# EAGLE design polarshield3.0c-opl (EAGLE 7.2.0)
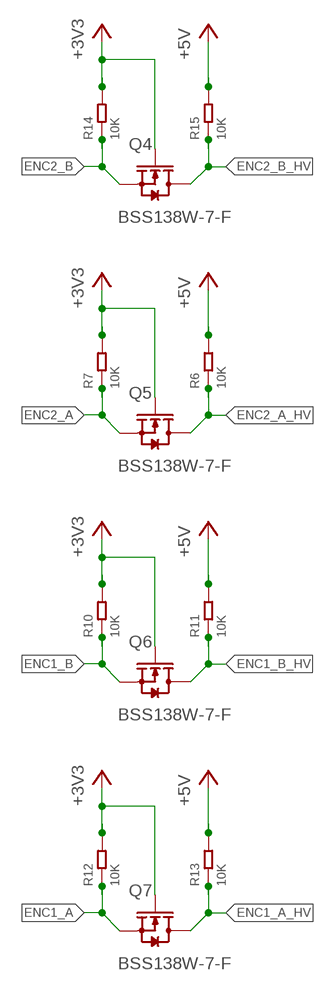
[diagram p0: schematic, sheet 1, part 1 of 2]
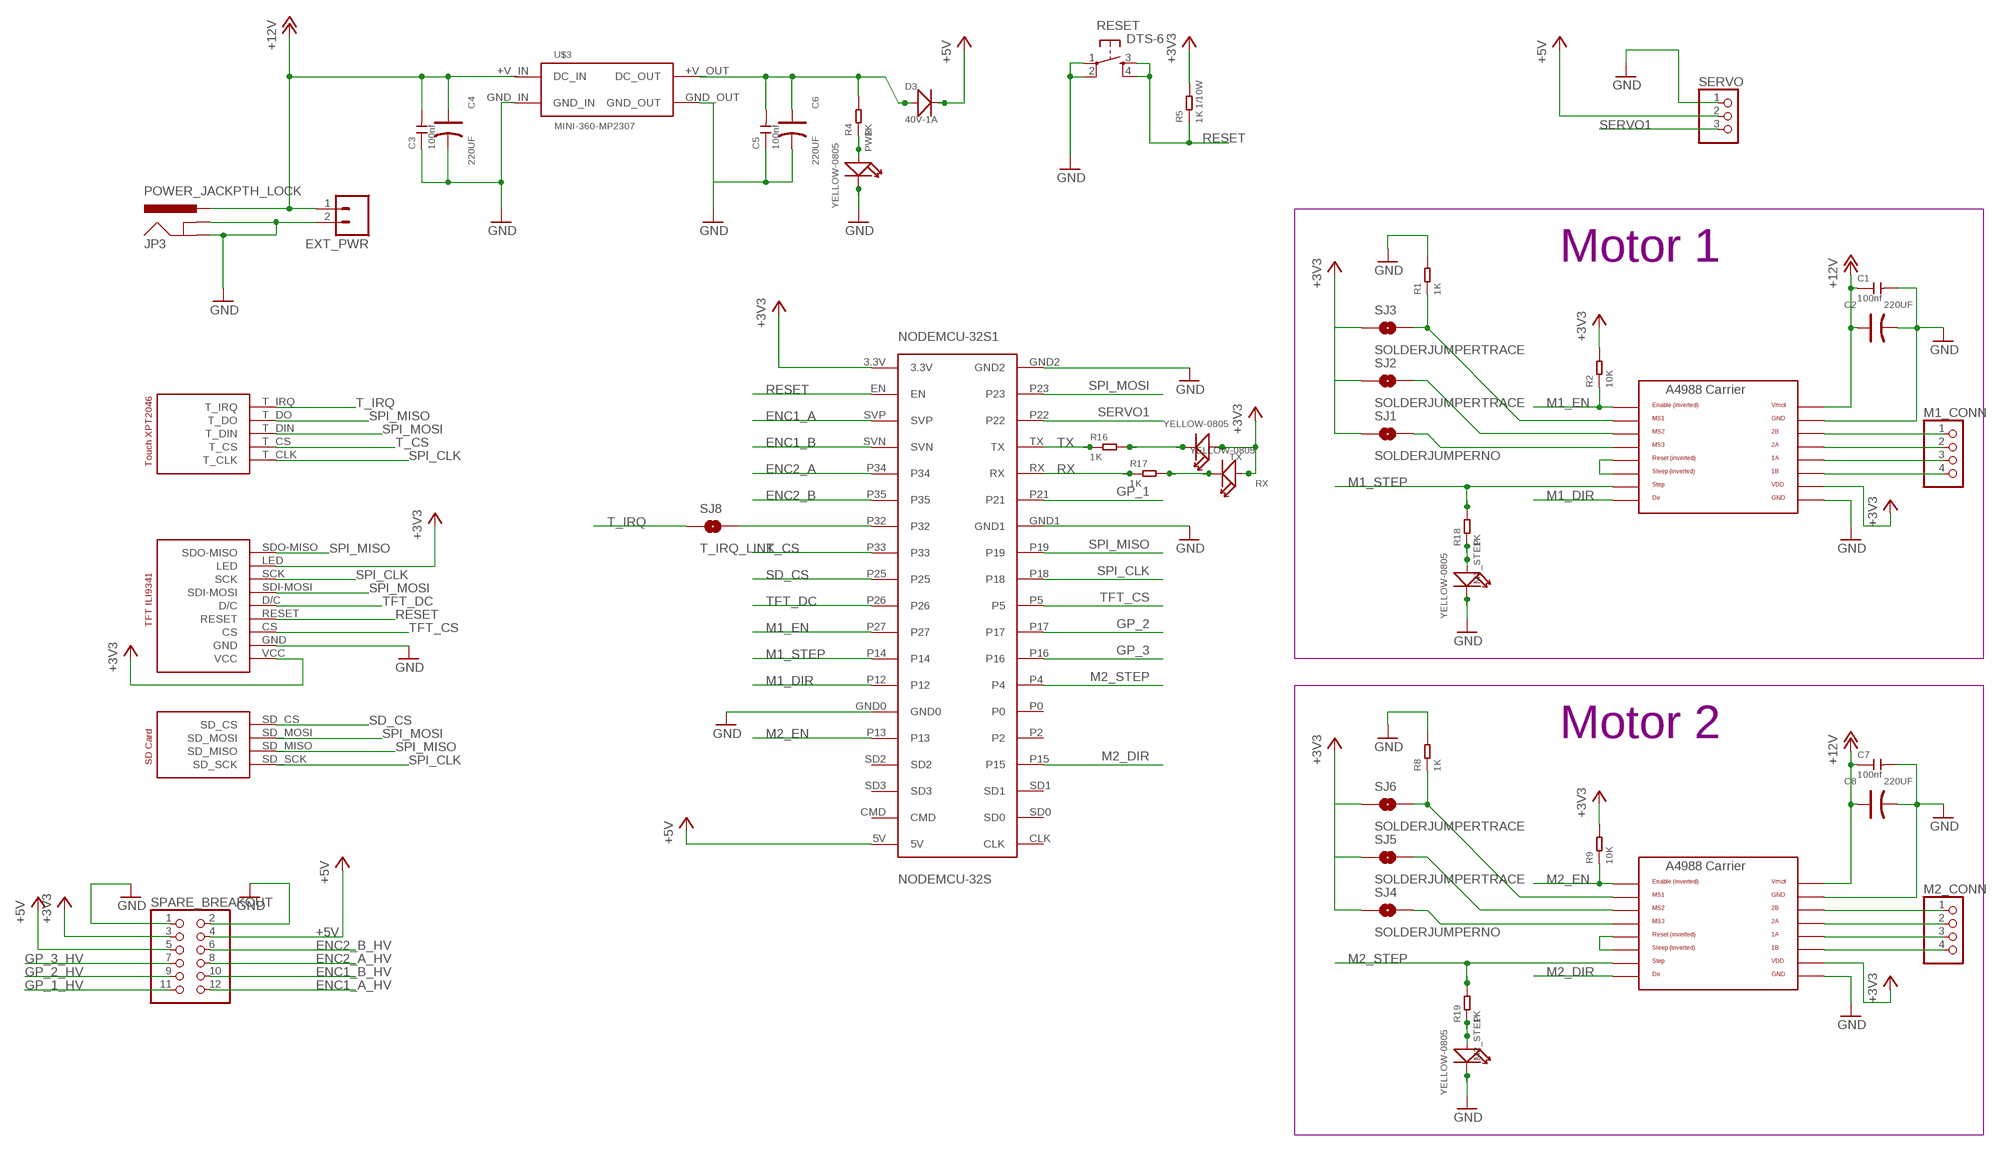
[diagram p1: schematic, sheet 1, part 2 of 2]

## Parts
C1  100nf  CERAMIC-100NF-50V-10%-X7R(0603)  [C0603]
C2  220UF  ALUMINUM-SMD-220UF-16V(D6.3-H7.7MM)  [ELECTRO-SMD-C-6MM]
C3  100nf  CERAMIC-100NF-50V-10%-X7R(0603)  [C0603]
C4  220UF  ALUMINUM-SMD-220UF-16V(D6.3-H7.7MM)  [ELECTRO-SMD-C-6MM]
C5  100nf  CERAMIC-100NF-50V-10%-X7R(0603)  [C0603]
C6  220UF  ALUMINUM-SMD-220UF-16V(D6.3-H7.7MM)  [ELECTRO-SMD-C-6MM]
C7  100nf  CERAMIC-100NF-50V-10%-X7R(0603)  [C0603]
C8  220UF  ALUMINUM-SMD-220UF-16V(D6.3-H7.7MM)  [ELECTRO-SMD-C-6MM]
D3  40V-1A  SMD-DIODE-SCHOTTKY-40V-1A(DO-214AC)  [DO-214AC]
EXT_PWR  M02PTH  [1X02]
JP3  POWER_JACKPTH_LOCK  [POWER_JACK_PTH_LOCK]
M1_CONN  PINHD-1X4/90  [1X04/90]
M1_STEP  YELLOW-0805  SMD-LED-CLEAR-YELLOW(0805)  [LED-0805]
M2_CONN  PINHD-1X4/90  [1X04/90]
M2_STEP  YELLOW-0805  SMD-LED-CLEAR-YELLOW(0805)  [LED-0805]
MOTOR_1  A4988BREAKOUT  [A4988BREAKOUT]
MOTOR_2  A4988BREAKOUT  [A4988BREAKOUT]
NODEMCU-32S1  NODEMCU-32S  [NODEMCU-32S]
PWR  YELLOW-0805  SMD-LED-CLEAR-YELLOW(0805)  [LED-0805]
Q4  BSS138W-7-F  SMD-MOSFET-N-CH-50V-200MA-BSS138W-7-F(SOT-23)  [SOT-23]
Q5  BSS138W-7-F  SMD-MOSFET-N-CH-50V-200MA-BSS138W-7-F(SOT-23)  [SOT-23]
Q6  BSS138W-7-F  SMD-MOSFET-N-CH-50V-200MA-BSS138W-7-F(SOT-23)  [SOT-23]
Q7  BSS138W-7-F  SMD-MOSFET-N-CH-50V-200MA-BSS138W-7-F(SOT-23)  [SOT-23]
R1  1K  SMD-RES-1K-5%-1/10W(0603)  [R0603]
R2  10K  SMD-RES-10K-5%-1/10W(0603)  [R0603]
R4  1K  SMD-RES-1K-5%-1/10W(0603)  [R0603]
R5  1K 1/10W  SMD-RES-1K-5%-1/10W(0603)  [R0603]
R6  10K  SMD-RES-10K-5%-1/10W(0603)  [R0603]
R7  10K  SMD-RES-10K-5%-1/10W(0603)  [R0603]
R8  1K  SMD-RES-1K-5%-1/10W(0603)  [R0603]
R9  10K  SMD-RES-10K-5%-1/10W(0603)  [R0603]
R10  10K  SMD-RES-10K-5%-1/10W(0603)  [R0603]
R11  10K  SMD-RES-10K-5%-1/10W(0603)  [R0603]
R12  10K  SMD-RES-10K-5%-1/10W(0603)  [R0603]
R13  10K  SMD-RES-10K-5%-1/10W(0603)  [R0603]
R14  10K  SMD-RES-10K-5%-1/10W(0603)  [R0603]
R15  10K  SMD-RES-10K-5%-1/10W(0603)  [R0603]
R16  1K  SMD-RES-1K-5%-1/10W(0603)  [R0603]
R17  1K  SMD-RES-1K-5%-1/10W(0603)  [R0603]
R18  1K  SMD-RES-1K-5%-1/10W(0603)  [R0603]
R19  1K  SMD-RES-1K-5%-1/10W(0603)  [R0603]
RESET  DTS-6  [DTS-6]
RX  YELLOW-0805  SMD-LED-CLEAR-YELLOW(0805)  [LED-0805]
SERVO  PINHD-1X3/90  [1X03/90]
SJ1  SOLDERJUMPERNO  [SJ_2S-NO]
SJ2  SOLDERJUMPERTRACE  [SJ_2S-TRACE]
SJ3  SOLDERJUMPERTRACE  [SJ_2S-TRACE]
SJ4  SOLDERJUMPERNO  [SJ_2S-NO]
SJ5  SOLDERJUMPERTRACE  [SJ_2S-TRACE]
SJ6  SOLDERJUMPERTRACE  [SJ_2S-TRACE]
SJ8  T_IRQ_LINK  SOLDERJUMPERNO  [SJ_2S-NO]
SPARE_BREAKOUT  PINHD-2X6  [2X06]
TX  YELLOW-0805  SMD-LED-CLEAR-YELLOW(0805)  [LED-0805]
U$2  2.4_TFT_SPI_TOUCH_SD  [2.4_TFT_SPI_TOUCH_SD]
U$3  MINI-360-MP2307  [MINI-360-MP2307]

## Nets
+3V3 [VCC]: MOTOR_1.VDD MOTOR_2.VDD NODEMCU-32S1.3.3V Q4.1(G) Q5.1(G) Q6.1(G) Q7.1(G) R2.2 R5.2 R7.2 R9.2 R10.2 R12.2 R14.2 RX.+ SJ1.1 SJ2.1 SJ3.1 SJ4.1 SJ5.1 SJ6.1 SPARE_BREAKOUT.3 TX.+ U$2.LED U$2.VCC
+5V [VCC]: D3.2(-) NODEMCU-32S1.5V R6.2 R11.2 R13.2 R15.2 SERVO.2 SPARE_BREAKOUT.4 SPARE_BREAKOUT.5
+12V [VMOT]: C1.1 C2.+ C3.2 C4.+ C7.1 C8.+ EXT_PWR.1 JP3.PWR MOTOR_1.VMOT MOTOR_2.VMOT U$3.+V_IN(DC_IN)
ENC1_A: NODEMCU-32S1.SVP Q7.2(S) R12.1
ENC1_A_HV: Q7.3(D) R13.1 SPARE_BREAKOUT.12
ENC1_B: NODEMCU-32S1.SVN Q6.2(S) R10.1
ENC1_B_HV: Q6.3(D) R11.1 SPARE_BREAKOUT.10
ENC2_A: NODEMCU-32S1.P34 Q5.2(S) R7.1
ENC2_A_HV: Q5.3(D) R6.1 SPARE_BREAKOUT.8
ENC2_B: NODEMCU-32S1.P35 Q4.2(S) R14.1
ENC2_B_HV: Q4.3(D) R15.1 SPARE_BREAKOUT.6
GND [GND]: C1.2 C2.- C3.1 C4.- C5.1 C6.- C7.2 C8.- EXT_PWR.2 JP3.GND JP3.GNDBREAK M1_STEP.- M2_STEP.- MOTOR_1.GND MOTOR_1.GND@0(GND) MOTOR_2.GND MOTOR_2.GND@0(GND) NODEMCU-32S1.GND0 NODEMCU-32S1.GND1 NODEMCU-32S1.GND2 PWR.- R1.2 R8.2 RESET.1 RESET.2 SERVO.1 SPARE_BREAKOUT.1 SPARE_BREAKOUT.2 U$2.GND U$3.GND_IN U$3.GND_OUT
GP_1: NODEMCU-32S1.P21
GP_1_HV: SPARE_BREAKOUT.11
GP_2: NODEMCU-32S1.P17
GP_2_HV: SPARE_BREAKOUT.9
GP_3: NODEMCU-32S1.P16
GP_3_HV: SPARE_BREAKOUT.7
M1_DIR: MOTOR_1.DIR NODEMCU-32S1.P12
M1_EN: MOTOR_1.EN NODEMCU-32S1.P27 R2.1
M1_STEP: MOTOR_1.STEP NODEMCU-32S1.P14 R18.2
M2_DIR: MOTOR_2.DIR NODEMCU-32S1.P15
M2_EN: MOTOR_2.EN NODEMCU-32S1.P13 R9.1
M2_STEP: MOTOR_2.STEP NODEMCU-32S1.P4 R19.2
N$1: NODEMCU-32S1.P32 SJ8.2
N$2: MOTOR_1.RST MOTOR_1.SLP(SLEEP)
N$3: MOTOR_1.MS3 SJ1.2
N$4: MOTOR_1.MS2 SJ2.2
N$5: MOTOR_1.MS1 R1.1 SJ3.2
N$6: M1_STEP.+ R18.1
N$7 [VCC]: C5.2 C6.+ D3.1(+) R4.2 U$3.+V_OUT(DC_OUT)
N$8: PWR.+ R4.1
N$9: MOTOR_2.MS3 SJ4.2
N$10 [VMOT]: M1_CONN.1 MOTOR_1.2B
N$11 [VMOT]: M1_CONN.2 MOTOR_1.2A
N$12 [VMOT]: M1_CONN.3 MOTOR_1.1A
N$13 [VMOT]: M1_CONN.4 MOTOR_1.1B
N$14: R16.2 TX.-
N$15: R17.2 RX.-
N$16: MOTOR_2.MS2 SJ5.2
N$17: MOTOR_2.MS1 R8.1 SJ6.2
N$18: MOTOR_2.RST MOTOR_2.SLP(SLEEP)
N$19: M2_STEP.+ R19.1
N$20 [VMOT]: M2_CONN.1 MOTOR_2.2B
N$21 [VMOT]: M2_CONN.2 MOTOR_2.2A
N$22 [VMOT]: M2_CONN.3 MOTOR_2.1A
N$23 [VMOT]: M2_CONN.4 MOTOR_2.1B
RESET: NODEMCU-32S1.EN R5.1 RESET.3 RESET.4 U$2.RESET
RX: NODEMCU-32S1.RX R17.1
SD_CS: NODEMCU-32S1.P25 U$2.SD_CS
SERVO1: NODEMCU-32S1.P22 SERVO.3
SPI_CLK: NODEMCU-32S1.P18 U$2.SCK U$2.SD_SCK U$2.T_CLK
SPI_MISO: NODEMCU-32S1.P19 U$2.SD_MISO U$2.SDO-MISO U$2.T_DO
SPI_MOSI: NODEMCU-32S1.P23 U$2.SD_MOSI U$2.SDI-MOSI U$2.T_DIN
T_CS: NODEMCU-32S1.P33 U$2.T_CS
T_IRQ: SJ8.1 U$2.T_IRQ
TFT_CS: NODEMCU-32S1.P5 U$2.CS
TFT_DC: NODEMCU-32S1.P26 U$2.D/C
TX: NODEMCU-32S1.TX R16.1
Unconnected: NODEMCU-32S1.CLK NODEMCU-32S1.CMD NODEMCU-32S1.P0 NODEMCU-32S1.P2 NODEMCU-32S1.SD0 NODEMCU-32S1.SD1 NODEMCU-32S1.SD2 NODEMCU-32S1.SD3

## Notes on the sheet
- Motor 1
- Motor 2

## Library data of the parts
C1 C3 C5 C7 = Seeed-Capacitor:CERAMIC-100NF-50V-10%-X7R(0603): 302010138; MPN: CC0603KRX7R9BB104
C2 C4 C6 C8 = Seeed-Capacitor:ALUMINUM-SMD-220UF-16V(D6.3-H7.7MM): 302030053; MPN: CS1E221M-CRE77
D3 = Seeed-Diode:SMD-DIODE-SCHOTTKY-40V-1A(DO-214AC): 304020027; MPN: 1N5819
EXT_PWR = SparkFun-Connectors:M02: Standard 2-pin 0.1" header. Use with - straight break away headers ( PRT-00116) - right angle break away headers (PRT-00553) - swiss pins (PRT-00743) - machine pins (PRT-00117) - female headers (PRT-00115) Molex polarized connector foot print use with: PRT-08233 with associated crimp pins and housings. 2.54_SCREWTERM for use with PRT-10571. 3.5mm Screw Terminal footprints for PRT-08084 5mm Screw Terminal footprints for use with PRT-08432
JP3 = SparkFun-Connectors:POWER_JACK: Power Jack This is the standard 5.5mm barrel jack for power. The PTH is the most common, proven, reliable, footprint. The Slot footprint only works if the mill layer is transmitted to the PCB fab house so be warned. Mating wall wart : TOL-00298 (and others); PROD_ID: CONN-08197; SF_ID: PRT-00119
M1_CONN M2_CONN = pinhead:PINHD-1X4: PIN HEADER
M1_STEP M2_STEP PWR RX TX = Seeed-LED:SMD-LED-CLEAR-YELLOW(0805): 304090039; MPN: 17-215UYC/S530-A3/TR8
MOTOR_1 MOTOR_2 = sandy:A4988BREAKOUT
NODEMCU-32S1 = sandy:NODEMCU-32S
Q4-Q7 = Seeed-Transistor:SMD-MOSFET-N-CH-50V-200MA-BSS138W-7-F(SOT-23): 305030000; MPN: BSS138W-7-F
R1 R4 R8 R16-R19 = Seeed-Resistor:SMD-RES-1K-5%-1/10W(0603): 301010291; MPN: RC0603JR-071KL; VALUE: 1K 1/10W
R2 R6 R7 R9-R15 = Seeed-Resistor:SMD-RES-10K-5%-1/10W(0603): 301010293; MPN: RC0603JR-0710KL; VALUE: 10K 1/10W
R5 = Seeed-Resistor:SMD-RES-1K-5%-1/10W(0603): 301010291; MPN: RC0603JR-071KL
RESET = switch-tact:DTS-6
SERVO = pinhead:PINHD-1X3: PIN HEADER
SJ1-SJ6 = polargraph3:SOLDERJUMPER: Solder Jumper Standard SMD solder jumper. Used to automate production. Two varients : Normally Open and Normally Closed are the same, but have different paste layers. NC will have a large amount of paste and should jumper during reflow.
SJ8 = SparkFun-Retired:SOLDERJUMPER: Solder Jumper Standard SMD solder jumper. Used to automate production. Two varients : Normally Open and Normally Closed are the same, but have different paste layers. NC will have a large amount of paste and should jumper during reflow.
SPARE_BREAKOUT = pinhead:PINHD-2X6: PIN HEADER
U$2 = polargraph3:2.4_TFT_SPI_TOUCH_SD
U$3 = polargraph3:MINI-360-MP2307

## Net classes
0 signal: width 0.254 mm, drill 0.152 mm, clearance 0.203 mm
1 VMOT: width 1.118 mm, drill 0.152 mm, clearance 0.305 mm
2 VCC: width 0.61 mm, drill 0.152 mm, clearance 0.203 mm
3 GND: width 0.305 mm, drill 0.152 mm, clearance 0.203 mm

## Board
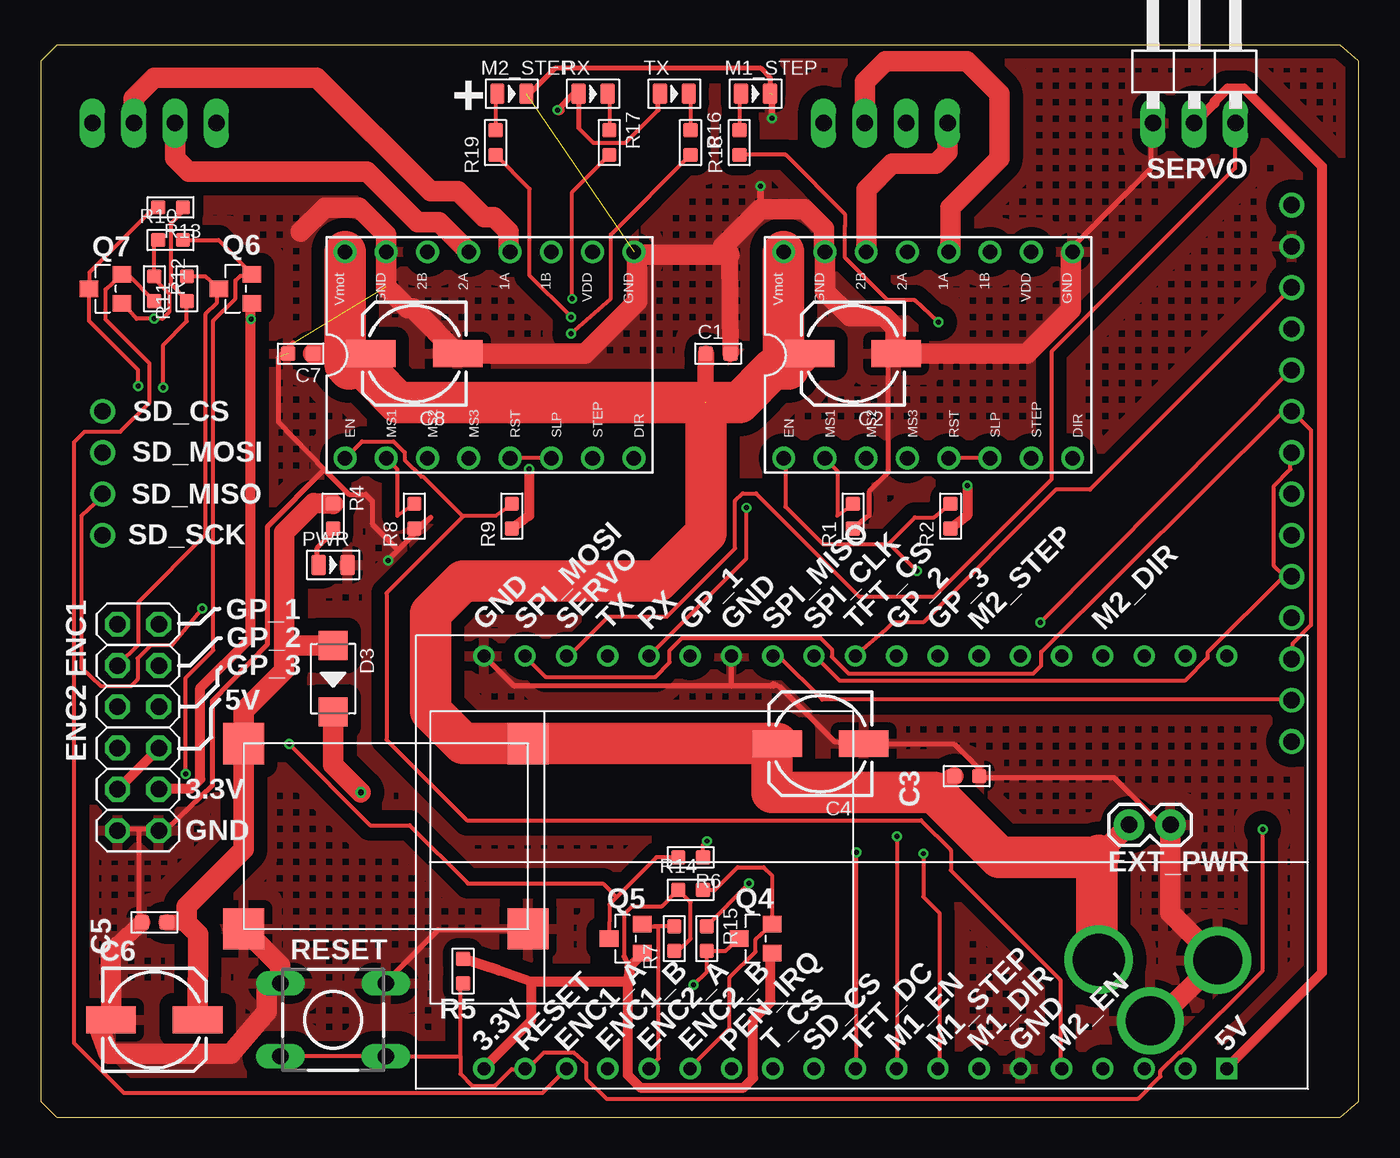
[diagram p2: board, top side]
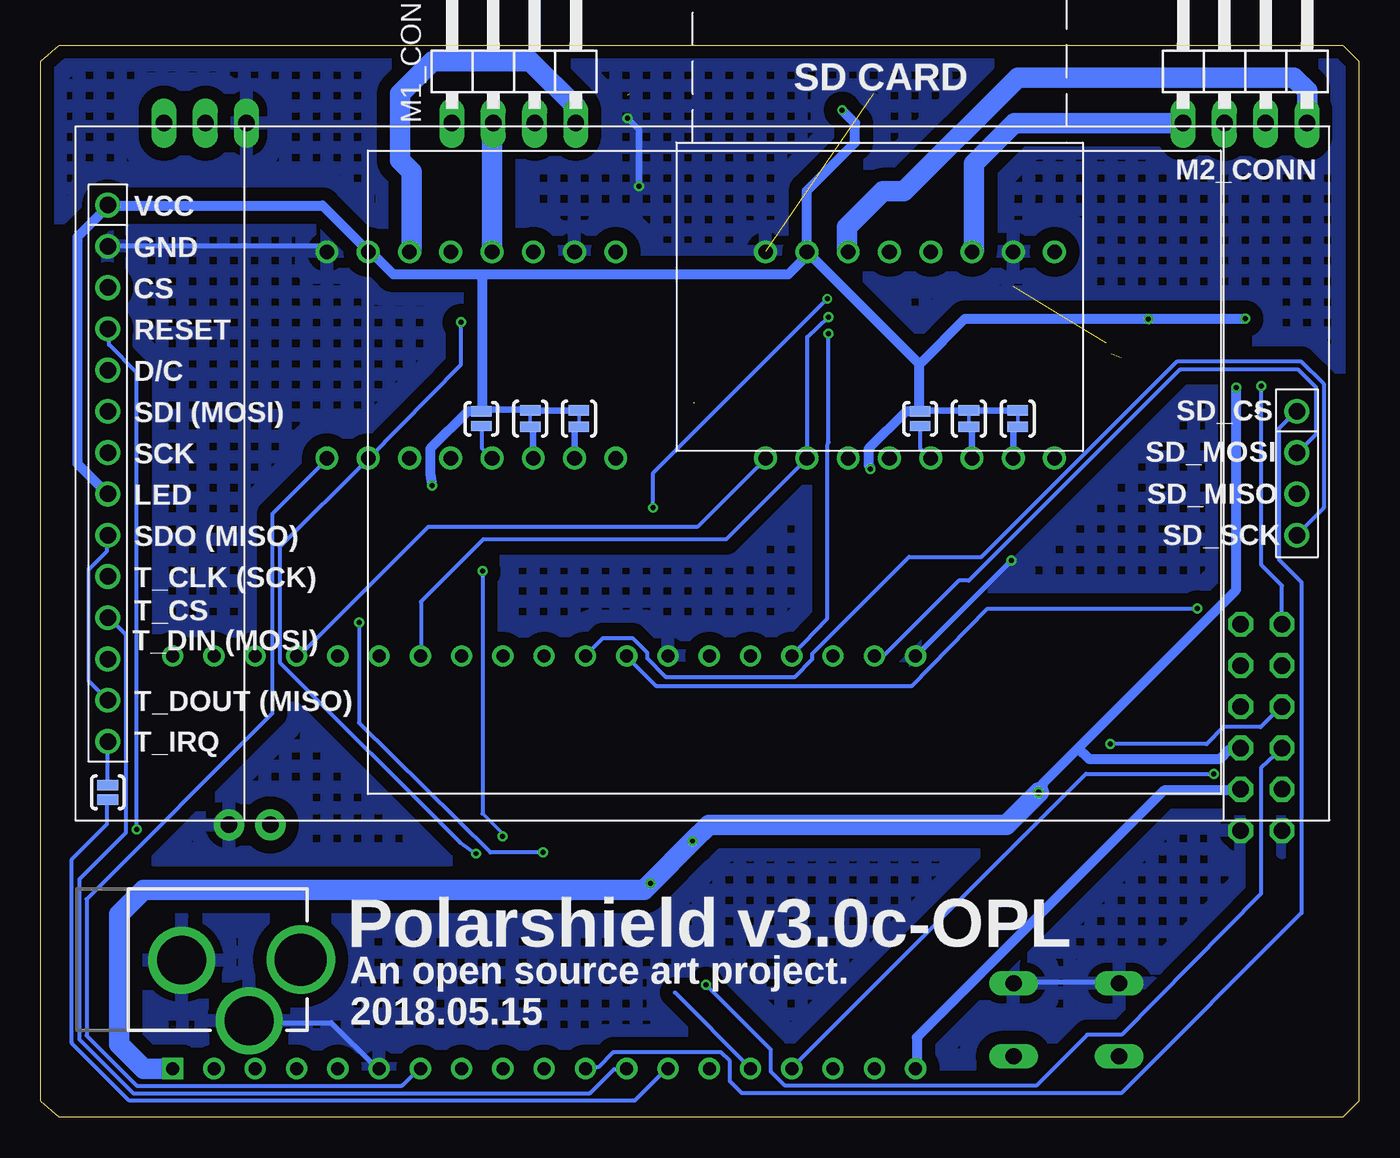
[diagram p3: board, bottom side, seen from below]

Size 81.13 x 66 mm. Coordinates in mm from the lower left corner, seen from the top.
Outline: 0,1 1,0 80,0 81.13,1 81.13,65 80,66 1,66 0,65 0,1
Copper layers (1*16): Top 0.035mm / dielectric 1.5mm / Bottom 0.035mm
Design rules "SeeedStudio_2layer_DRU_no_angle_20140221 *": minimum track width 6mil, minimum drill 12mil, track to track 6mil, track to pad 6mil, pad to pad 6mil, via to via 6mil, smd to smd 0mil, copper to edge 10mil, drill to drill 10mil, minimum pad ring 10mil, minimum via ring 6mil, stop-mask expansion 2mil, vias tented up to drill 100mil, thermal gap 20mil

### Footprints (pad centres in the part's own frame; a part is rotated, then mirrored left to right if it is on the bottom)
C0603 = smd 0.889 x 0.889: 1 0,0.762; 2 0,-0.762
ELECTRO-SMD-C-6MM = smd 3.048 x 1.651: + 2.667,0; - -2.667,0
DO-214AC = smd 1.8 x 1.77: 1 -2.042,0; 2 2.042,0
1X02 = drill 1.016 pad 1.88: 1 0,0; 2 2.54,0
POWER_JACK_PTH_LOCK = drill 2.997 pad 4.115: GND 0.025,6.557; GNDBREAK 3.762,10.7 | drill 3.2 pad 4.115: PWR 0,13.878
1X04/90 = drill 1.016 long: 1 -3.81,-3.81; 2 -1.27,-3.81; 3 1.27,-3.81; 4 3.81,-3.81
LED-0805 = smd 0.889 x 1.27: + -0.889,0; - 0.889,0
A4988BREAKOUT = drill 0.9: 1A 8.89,1.27; 1B 11.43,1.27; 2A 6.35,1.27; 2B 3.81,1.27; DIR 16.51,-11.43; EN -1.27,-11.43; GND 16.51,1.27; GND@0 1.27,1.27; MS1 1.27,-11.43; MS2 3.81,-11.43; MS3 6.35,-11.43; RST 8.89,-11.43; SLP 11.43,-11.43; STEP 13.97,-11.43; VDD 13.97,1.27; VMOT -1.27,1.27
NODEMCU-32S = drill 0.8: 3.3V 0,45.72; CLK 25.4,0; CMD 0,2.54; EN 0,43.18; GND0 0,12.7; GND1 25.4,30.48; GND2 25.4,45.72; P0 25.4,12.7; P2 25.4,10.16; P4 25.4,15.24; P5 25.4,22.86; P12 0,15.24; P13 0,10.16; P14 0,17.78; P15 25.4,7.62; P16 25.4,17.78; P17 25.4,20.32; P18 25.4,25.4; P19 25.4,27.94; P21 25.4,33.02; P22 25.4,40.64; P23 25.4,43.18; P25 0,25.4; P26 0,22.86; P27 0,20.32; P32 0,30.48; P33 0,27.94; P34 0,35.56; P35 0,33.02; RX 25.4,35.56; SD0 25.4,2.54; SD1 25.4,5.08; SD2 0,7.62; SD3 0,5.08; SVN 0,38.1; SVP 0,40.64; TX 25.4,38.1 | drill 0.8 square: 5V 0,0
SOT-23 = smd 1.016 x 1.143: 1 -0.889,-1.016; 2 0.889,-1.016; 3 0,1.016
R0603 = smd 0.889 x 0.889: 1 0,0.762; 2 0,-0.762
DTS-6 = drill 1 long: 1 -3.25,2.25; 2 3.25,2.25; 3 -3.25,-2.25; 4 3.25,-2.25
1X03/90 = drill 1.016 long: 1 -2.54,-3.81; 2 0,-3.81; 3 2.54,-3.81
SJ_2S-NO = smd 0.635 x 1.27: 1 -0.45,0; 2 0.45,0
SJ_2S-TRACE = smd 0.635 x 1.27: 1 -0.508,0; 2 0.508,0
2X06 = drill 1.016 octagon: 1 -6.35,-1.27; 2 -6.35,1.27; 3 -3.81,-1.27; 4 -3.81,1.27; 5 -1.27,-1.27; 6 -1.27,1.27; 7 1.27,-1.27; 8 1.27,1.27; 9 3.81,-1.27; 10 3.81,1.27; 11 6.35,-1.27; 12 6.35,1.27
2.4_TFT_SPI_TOUCH_SD = drill 1.016: CS 9.93,2; D/C 15.01,2; GND 7.39,2; LED 22.63,2; RESET 12.47,2; SCK 20.09,2; SD_CS 17.55,75.18; SD_MISO 22.63,75.18; SD_MOSI 20.09,75.18; SD_SCK 25.17,75.18; SDI-MOSI 17.55,2; SDO-MISO 25.17,2; T_CLK 27.71,2; T_CS 30.25,2; T_DIN 32.79,2; T_DO 35.33,2; T_IRQ 37.87,2; VCC 4.85,2
MINI-360-MP2307 = smd 2.54 x 2.54: +V_IN -1,-1; +V_OUT 16.5,-1; GND_IN -1,10.4; GND_OUT 16.5,10.4

### Placement (x,y rotation side)
C1  41.7,47 90 top
C2  50,47 180 top
C3  57,21 270 top
C4  48,23 180 top
C5  7,12 90 top
C6  7,6 0 top
C7  16,47 270 top
C8  23,47 180 top
D3  18,27 270 top
EXT_PWR  67,18 0 top
JP3  79,9.7 270 bottom
M1_CONN  52,65 0 bottom
M1_STEP  44,63 0 top
M2_CONN  7,65 0 bottom
M2_STEP  29,63 0 top
MOTOR_1  47,52 0 top
MOTOR_2  20,52 0 top
NODEMCU-32S1  73,3 90 top
PWR  18,34 0 top
Q4  44,11 90 top
Q5  36,11 90 top
Q6  12,51 90 top
Q7  4,51 90 top
R1  50,37 0 top
R2  56,37 0 top
R4  18,37 180 top
R5  26,9 180 top
R6  40,16 90 top
R7  39,11 0 top
R8  23,37 0 top
R9  29,37 0 top
R10  8,54 270 top
R11  9,51 0 top
R12  7,51 180 top
R13  8,56 90 top
R14  40,14 270 top
R15  41,11 180 top
R16  40,60 180 top
R17  35,60 180 top
R18  43,60 0 top
R19  28,60 0 top
RESET  18,6 0 top
RX  34,63 0 top
SERVO  71,65 0 top
SJ1  54,43 270 bottom
SJ2  51,43 270 bottom
SJ3  48,43 270 bottom
SJ4  27,43 270 bottom
SJ5  24,43 270 bottom
SJ6  21,43 270 bottom
SJ8  77,20 270 bottom
SPARE_BREAKOUT  6,24 90 top
TX  39,63 0 top
U$2  79,61 270 bottom
U$3  29,22 180 top

### Tracks (layer width: path | path; a pad name or v marks a point on that pad's centre or on a via)
+3V3  (via drill 0.3)
  Top 0.254: 35.9,9.9 35.9,12.5 36.4,13 38.24,13 R14.2 40,13.24 40,11 39.24,10.24 R7.2 | 36.2,9.2 36.2,9.03 36.23,9 | Q7.1 5.9,49.15 v6.99,49.15 7.5,49.15 7.9,49.55 7.9,50.7 7.24,51.36 R12.2 7,53.76 R10.2 | 33.11,60.89 34,60 36,60 38,62
  Top 0.305: 35.9,9.9 36.2,9.2 | RX.+ 33.11,60.89 | 38,62 38,62.89 TX.+
  Top 0.406: RX.+ 32.8,63 v31.8,62 | 38,63.11 TX.+
  Top 0.61: v30.06,39.89 30.06,37.03 R9.2 | 5.03,49.95 Q7.1 | v57.04,38.89 57.04,37.03 R2.2 | 36.13,8.34 36.23,9 36.23,9.26 36.92,9.94 Q5.1 | 36.13,8.34 36.13,2.62 36.92,1.83 43.26,1.83 43.85,2.42 43.85,6.01 44.92,7.09 44.92,9.94 Q4.1 | 36.13,8.34 30.18,8.34 | 30.18,8.34 30.18,5.94 27.32,3.09 NODEMCU-32S1.3.3V | 12.92,49.03 12.92,29.52 9.83,26.43 9.83,20.8 9.26,20.23 7.32,20.23 SPARE_BREAKOUT.3 | 12.92,49.03 12.92,49.95 Q6.1 | v12.94,49.13 12.92,49.03 | 30.18,8.34 28.19,9.04 R5.2 | v31.8,62 31.95,62
  Bottom 0.406: SJ6.1 SJ5.1 27,43.51 SJ4.1 | SJ3.1 SJ2.1 51,43.55 53.95,43.55
  Bottom 0.61: 27.09,46.41 27.09,43.55 SJ4.1 27.32,43.43 27.89,43.43 30.18,41.15 30.18,40.12 30.06,40.01 v30.06,39.89 | 27.09,46.41 33.95,53.26 MOTOR_2.VDD | 61.04,53.38 | 61.04,53.38 63.78,56.12 76.92,56.12 U$2.VCC 77.15,55.89 78.87,54.18 78.87,40.23 77.04,38.41 U$2.LED | 61.04,53.38 MOTOR_1.VDD 60.69,53.15 59.44,51.89 53.95,51.89 | 53.95,51.89 35.12,51.89 33.98,53.03 34.18,53.03 MOTOR_2.VDD | 53.95,51.89 53.95,43.55 SJ1.1 54.29,43.43 54.86,43.43 57.15,41.15 57.15,39.6 v57.04,38.89 | 13.14,49.15 24.23,49.15 26.86,46.52 27.09,46.41 | 13.14,49.15 v6.99,49.15 | NODEMCU-32S1.3.3V 27.2,3.09 27.2,4.92 12,20.12 7.32,20.12 SPARE_BREAKOUT.3 | v12.94,49.13 13.14,49.15 | MOTOR_2.VDD 33.97,57.03 31,60 31,61.2 v31.8,62
+5V  (via drill 0.3, 0.35)
  Top 0.254: R15.2 41,11.8 v43.6,14.4 | R6.2 40.76,16.76 v41,17 | R13.2 8.76,55.76 8,55 8,51.3 9,50.3 R11.2 9,49 7.54,47.54 v7.54,44.92
  Top 0.61: SPARE_BREAKOUT.4 4.8,20.23 7.2,22.63 SPARE_BREAKOUT.5 | SERVO.2 71.09,61.27 72.24,62.41 72.24,62.52 73.04,63.32 74.07,63.32 78.87,58.52 78.87,8.91 73.04,3.09 NODEMCU-32S1.5V
  Top 1.27: v19.7,20 18,21.7 D3.2
  Bottom 0.254: v43.6,14.4 44.1,14.4 44.5,14
  Bottom 0.61: v7.54,44.92 7.54,32.46 17.29,22.72 | 17.29,22.72 19.43,20.57 v19.7,20 | 17.29,22.72 16.63,22.06 8.57,22.06 8,22.63 7.32,22.63 SPARE_BREAKOUT.5
  Bottom 1.27: NODEMCU-32S1.5V 74.8,3 76.3,4.5 76.3,12.5 74.8,14 44.5,14 44,14 v43.6,14.4 v41,17 40,18 21.7,18 v19.7,20
+12V  (1 unrouted)
  Top 1.016: C1.1 40.9,44
  Top 1.118: C3.2 56.01,20.92 55.89,20.8 55,20
  Top 1.27: JP3.PWR 65.12,16.12 EXT_PWR.1 | C7.1 18.73,47
  Top 1.676: 20.3,45.7 C8.+ 19.35,46.05 19,46.05 | C2.+ 46.35,46.05 46,46.05 45.73,46.32
  Top 2.54: MOTOR_2.VMOT 18.73,47 18.73,46.32 19,46.05 | 20.3,45.7 22,44 40.9,44 43,44 45.05,46.05 46,46.05 | MOTOR_1.VMOT 45.73,46.32 | 40.95,44 40.95,35.95 38,33 26,33 24,31 24,25 26,23 U$3.+V_IN C4.+ 45,22.7 45,20 55,20 59,16 65,16 | 65.12,16.12 65,16 | 65,16 65,10
ENC1_A
  Top 0.254: 5.03,52.01 Q7.2 | 4.92,51.89 Q7.2 | NODEMCU-32S1.SVP 32.35,2.97 30.86,1.49 5.14,1.49 2.06,4.57 2.06,41.56 2.7,42.2 4.9,42.2 6.7,44 6.7,46.4 4,49.1 4,50.95 Q7.2 | Q7.2 5.29,51.95 R12.1
ENC1_A_HV  (via drill 0.3)
  Top 0.254: v6,45 6,46 2.97,49.03 2.97,51.09 Q7.3 3,51.1 3,52 7,56 R13.1
  Bottom 0.254: SPARE_BREAKOUT.12 4.73,32.73 6,34 v6,45
ENC1_B  (via drill 0.3)
  Top 0.254: 12.92,52.01 Q6.2 | v8.91,21.14 8.91,27.03 10.63,28.75 10.63,49.03 12,50.4 12,51.5 12.3,51.8 12.93,51.8 Q6.2 | 12.92,51.89 Q6.2 | R10.1 10.95,54 Q6.2
  Bottom 0.254: v8.91,21.14 16.8,21.14 34.86,3.09 NODEMCU-32S1.SVN
ENC1_B_HV
  Top 0.254: 10.97,51.09 Q6.3 | Q6.3 10.86,50.98 10.86,50.15 10.17,49.46 10.17,35.86 6.03,31.72 6.03,29.12 4.8,27.89 SPARE_BREAKOUT.10 | R11.1 10.14,51.76 Q6.3
ENC2_A
  Top 0.254: 37.33,11.73 38.03,11.73 38.03,3.63 37.49,3.09 NODEMCU-32S1.P34 | 37.33,11.73 37.03,11.63 37.03,11.89 Q5.2 | R7.1 37.76,11.76 37.33,11.73
  Bottom 0.254: 42.09,7.69 37.49,3.09 NODEMCU-32S1.P34
ENC2_A_HV  (via drill 0.3)
  Top 0.254: 34.98,11.32 34.98,11.09 Q5.3 | v15.29,22.97 20.29,17.97 22.72,17.97 26.3,14.4 34.6,14.4 35.45,13.55 | 34.86,11.32 Q5.3 | 35.45,13.55 35,13.1 Q5.3 | R6.1 37.9,16 35.45,13.55
  Bottom 0.254: v15.29,22.97 9.37,22.97 8.33,24.02 6.04,24.02 4.8,25.26 SPARE_BREAKOUT.8
ENC2_B
  Top 0.254: 44.92,11.66 44.92,11.89 Q4.2 | NODEMCU-32S1.P35 40.01,3.09 42.41,5.49 42.41,8.61 44,10.2 44,10.95 Q4.2 | R14.1 41.5,14 42.9,15.4 44.5,15.4 45,14.9 Q4.2
ENC2_B_HV  (via drill 0.3)
  Top 0.254: 42.86,11.09 Q4.3 42.14,10.24 R15.1 41,8.97 v40.18,8.14
  Bottom 0.254: v40.18,8.14 36.19,4.16 36.19,2.81 35.32,1.94 19.86,1.94 16.72,5.09 14.6,5.09 6.03,13.76 6.03,21.5 4.8,22.63 SPARE_BREAKOUT.6
GND  (via drill 0.3)  (4 unrouted)
  Top 0.305: R1.2 50.98,37.03 50.98,38.51 52.13,39.66 52.13,46.53 C2.- | SERVO.1 68.35,61.15 68.35,58.41 63.78,53.84 MOTOR_1.GND | 6.06,17.72 7.2,17.72 SPARE_BREAKOUT.1 7.32,17.72 7.77,17.72 10.56,20.4 10.56,25.63 13.95,29.12 13.95,36.35 17.46,39.86 | 6.06,17.72 4.8,17.72 SPARE_BREAKOUT.2 | U$3.GND_IN 29.95,11.54 24.46,11.54 21.26,8.34 RESET.2 | 6.06,17.72 6.06,12.57 C5.1 | 22,34.92 24,36.92 R8.2 | 22,34.92 21.43,34.35 21.49,34.29 v21.39,34.28 | 22,34.92 20.4,36.52 20.4,37.95 20.02,38.33 18.99,38.33 17.46,39.86 | 17.46,39.86 14.63,42.79 14.63,46.75 15.54,47.66 | 45.12,26.55 44.9,26.55 | 44.9,26.55 42.5,26.55 | 42.5,26.55 29.15,26.55 27.35,28.35 27.32,28.35 NODEMCU-32S1.GND2 | EXT_PWR.2 68.92,18.06 66.06,20.92 58.06,20.92 C3.1 57.84,21.03 57.84,21.37 56.24,22.97 50.75,22.97 C4.- 50.63,23.09 48.91,23.09 45.5,26.5 45.1,26.7 44.9,26.55 | 42.52,28.35 42.5,28.35 42.5,26.55
  Top 0.406: 44.3,55.9 v44.3,57.3 | v45,61.5 45,62.95
  Top 1.016: C1.2 42.4,53.1 | C5.1 4.3,10.25
  Top 1.27: MOTOR_1.GND 63.4,53.16 63.4,49.7 60.7,47 C2.- 52.6,47.1 52.6,48.6 51.9,49.3 49.8,49.3 48.27,50.83 MOTOR_1.GND@0 48.2,53.34 48.2,54.7 47,55.9 44.3,55.9 42,53.6 42.4,53.1 36.68,53.1 MOTOR_2.GND 36.7,53.08 36.7,50.2 33.5,47 C8.- 22.9,49.8 22.6,49.8 21.27,51.13 MOTOR_2.GND@0 21.27,54.33 19.6,56 17.5,56 16,54.5 | EXT_PWR.2 69.54,12.58 JP3.GND 68.71,5.94 JP3.GNDBREAK | 4.3,10.25 C6.- 3.6,5.7 3.6,5.5 4.2,3.9 11.7,3.9 13.9,6.5 13.9,7.8 14.35,8.25 RESET.1 14.75,9.35 U$3.GND_OUT
  Bottom 0.305: RESET.1 14.86,8.34 21.14,8.34 RESET.2 | U$2.GND 76.92,53.61 63.78,53.61 63.55,53.38 MOTOR_1.GND | NODEMCU-32S1.GND0 60.35,3.09 60.49,3.09 63.24,5.83 68.24,5.83 JP3.GNDBREAK | v21.39,34.28 27.2,28.46 NODEMCU-32S1.GND2
  Bottom 0.406: v44.3,57.3 44.3,60.8 v45,61.5
  pour Bottom (isolate 0.813, hatched): 0.6,64.7 0.6,1.6 1.7,0.5 79.5,0.5 80.6,1.6 80.6,64.1 79.4,65.3 1.2,65.3
  pour Top (isolate 0.813, hatched): 0.8,64.6 0.8,1.5 1.8,0.5 79.7,0.5 80.6,1.4 80.6,64.5 79.6,65.5 1.7,65.5
M1_DIR
  Bottom 0.254: NODEMCU-32S1.P12 57.84,2.97 57.86,2.97 58.89,1.94 75.21,1.94 78.3,5.03 78.3,13.43 66.86,24.86 66.86,37.15 63.55,40.46 MOTOR_1.DIR
M1_EN  (via drill 0.3)
  Top 0.254: 52.22,35.33 52.16,35.28 48.15,35.28 45.83,37.59 45.83,40.46 MOTOR_1.EN | 52.22,35.33 53.81,36.92 54.98,36.92 R2.1 | 52.22,35.33 v53.94,33.62 | NODEMCU-32S1.P27 52.69,3.09 v52.69,17.29 v52.7,17.3
  Bottom 0.203: v52.7,17.3 52.7,17.46 53.94,18.7
  Bottom 0.254: v53.94,33.62 53.94,18.7
M1_STEP  (via drill 0.3)
  Top 0.254: v55.26,48.94 53.81,50.29 52.12,50.29 49.51,52.91 49.51,54.85 49.5,54.86 49.5,55.6 45.86,59.24 R18.2 | v54.32,16.23 54.32,13.58 55.3,12.6 55.32,3.09 NODEMCU-32S1.P14
  Bottom 0.254: v55.26,48.94 55.26,46.33 60.92,40.58 MOTOR_1.STEP 61.04,40.46 66.41,35.09 66.41,28 55.32,16.92 v54.32,16.23
M2_DIR
  Bottom 0.254: NODEMCU-32S1.P15 65.38,28.46 65.15,28.46 57.28,36.33 40.7,36.33 36.58,40.46 MOTOR_2.DIR
M2_EN
  Top 0.254: 25.95,37.03 28,37.03 R9.1 | 25.95,37.03 23.55,39.43 23.43,39.43 22.4,40.46 22.4,40.92 21.72,41.6 19.77,41.6 18.75,40.58 MOTOR_2.EN | NODEMCU-32S1.P13 62.75,3.09 62.75,8.46 56.01,15.2 56.01,16.46 54.18,18.29 26.23,18.29 21.29,23.23 21.29,32.26 25.95,36.92 25.95,37.03
M2_STEP  (via drill 0.3)
  Top 0.254: v32.63,49.25 32.63,49.33 32.57,49.33 30.1,51.8 30.1,57.14 R19.2
  Bottom 0.254: v32.63,49.25 33.95,48.03 33.95,40.58 MOTOR_2.STEP 34.06,40.46 38.95,35.58 53.89,35.58 57.72,31.75 57.72,28.46 NODEMCU-32S1.P4
N$1
  Bottom 0.254: SJ8.2 77.04,19.55 77.04,18.06 79.21,15.89 79.21,4.57 75.67,1.03 44.58,1.03 42.63,2.97 NODEMCU-32S1.P32
N$2
  Top 0.254: MOTOR_1.RST 58.41,40.58 MOTOR_1.SLP
N$3
  Bottom 0.254: SJ1.2 53.95,42.52 53.95,41.15 53.38,40.58 MOTOR_1.MS3
N$4
  Bottom 0.406: SJ2.2 50.81,42.49 MOTOR_1.MS2
N$5
  Top 0.254: R1.1 49.03,37.03 49.03,39.78 48.35,40.46 MOTOR_1.MS1
  Bottom 0.406: SJ3.2 48.27,42.49 MOTOR_1.MS1
N$6
  Top 0.254: 42.98,62.98 43,62.96 R18.1
  Top 0.406: 43,62.96 43.07,62.96 M1_STEP.+
N$7
  Top 1.016: 8.97,11.97 C5.2
  Top 1.27: C6.+ 9.7,11.25 8.97,11.97 9,12 9,13 12.5,16.5 U$3.+V_OUT 12.5,25 15,27.5 15,29 | 15,29 15.05,29.05 15.06,29.04 D3.1 | R4.2 16.8,37.8 15,36 15,29
N$8
  Top 0.305: R4.1 18,36 17,35 17,34.11 PWR.+
N$9
  Bottom 0.254: SJ4.2 26.98,42.52 26.98,41.15 26.4,40.58 MOTOR_2.MS3
N$10
  Top 1.016: M1_CONN.1
  Top 1.27: MOTOR_1.2B 50.81,57.11 52.4,58.7 55.1,58.7 55.8,59.4 M1_CONN.1
N$11
  Bottom 1.016: 53.35,61.11 M1_CONN.2
  Bottom 1.27: MOTOR_1.2A 53.35,61.11
N$12
  Top 1.27: M1_CONN.3 50.73,63.73 52,65 57,65 59,63 59,59 56,56 56,53.38 MOTOR_1.1A
N$13
  Bottom 1.27: M1_CONN.4 48.19,62.19 51,65 57,65 59,63 59,58.9 58.3,58.2 58.3,53.4 MOTOR_1.1B
N$14
  Top 0.254: 40,62.95 R16.2
  Top 0.406: 40,62.95 39.94,62.95 TX.-
N$15
  Top 0.254: 34.98,62.98 35,62.95 R17.2
  Top 0.406: 34.98,62.98 34.91,62.98 RX.-
N$16
  Bottom 0.406: SJ5.2 23.81,42.49 MOTOR_2.MS2
N$17
  Top 0.254: R8.1 21.95,37.03 21.95,39.89 21.37,40.46 MOTOR_2.MS1
  Bottom 0.406: SJ6.2 21.27,42.49 MOTOR_2.MS1
N$18
  Top 0.254: MOTOR_2.RST 28.92,40.58 31.32,40.58 MOTOR_2.SLP
N$19
  Top 0.254: 28,62.98 R19.1
  Top 0.406: 28,62.98 28.09,62.98 M2_STEP.+
N$20
  Bottom 1.27: M2_CONN.1 21.21,61.19 23.7,58.7 23.7,53.38 MOTOR_2.2B
N$21
  Top 1.27: M2_CONN.2 8.27,59.03 9.1,58.2 20.1,58.2 23.2,55.1 24.52,55.1 MOTOR_2.2A
N$22
  Top 1.27: M2_CONN.3 5.73,62.73 7,64 17,64 24,57 25.7,57 27.3,55.4 27.9,55.4 28.8,54.5 28.8,53.36 MOTOR_2.1A
N$23
  Bottom 1.27: M2_CONN.4 3.19,63.19 4,64 21,64 28,57 29.3,57 31.5,54.8 31.5,53.34 MOTOR_2.1B
N$24
  Top 0.305: 29.9,63 30.1,63 31.7,64.6 44.3,64.6 44.9,64 44.9,63
RESET  (via drill 0.3)
  Top 0.254: 25.83,3.77 21.26,3.77 RESET.4 21.14,3.77 14.86,3.77 RESET.3 | 25.83,3.77 25.83,2.67 26.56,1.94 27.96,1.94 28.99,2.97 29.72,2.97 NODEMCU-32S1.EN 29.95,2.97 30.98,4 32.8,4 33.58,3.33 33.58,2.39 34.82,1.14 67.55,1.14 68.92,2.52 68.92,2.86 70.07,4 70.18,4 75.21,9.03 v75.21,17.73 | 25.83,3.77 25.83,7.78 R5.1
  Bottom 0.254: v75.21,17.73 75.21,45.83 76.92,47.55 76.92,48.46 U$2.RESET
RX  (via drill 0.3)
  Top 0.254: v43.43,37.52 43.43,34.4 37.49,28.46 NODEMCU-32S1.RX | v32.72,50.38 32.72,56.96 R17.1
  Bottom 0.254: v32.72,50.38 43.43,39.66 v43.43,37.52
SD_CS
  Bottom 0.254: NODEMCU-32S1.P25 47.55,3.09 46.81,3.09 45.89,4 39.25,4 38.72,3.47 38.72,2.23 37.98,1.49 14.63,1.49 3.54,12.57 3.54,32.95 4.92,34.32 4.92,42.41 3.89,43.43 U$2.SD_CS
SERVO1
  Top 0.254: NODEMCU-32S1.P22 32.46,28.46 32.59,28.46 34.93,30.8 38.53,30.8 42.75,35.02 42.75,37.95 43.2,38.4 44.04,38.4 50.41,32.03 54.98,32.03 62.21,39.26 62.21,47.12 73.5,58.41 73.5,61.15 SERVO.3
SPI_CLK
  Top 0.254: NODEMCU-32S1.P18 47.66,28.35 47.71,28.35 49.19,26.86 70.41,26.86 71.81,28.26 71.81,28.6 76.47,33.26 76.92,33.26 U$2.T_CLK 76.47,33.38 75.89,33.95 75.89,38.86 76.92,39.89 76.92,40.8 U$2.SCK
  Bottom 0.254: U$2.SD_SCK 3.77,35.89 3.77,35.91 2.17,37.51 2.17,45.15 3.53,46.51 11.21,46.51 23.23,34.49 27.69,34.49 33.63,28.55 33.63,28.2 34.72,27.12 42.66,27.12 43.81,28.26 43.81,28.6 44.69,29.49 46.52,29.49 47.55,28.46 NODEMCU-32S1.P18
SPI_MISO  (via drill 0.3)
  Top 0.254: NODEMCU-32S1.P19 45.15,28.35 45.48,28.35 48.11,25.72 76.92,25.72 U$2.T_DO | v9.94,31.32 8.07,29.05 6.77,29.05 5.97,28.25 5.97,26.96 5.54,26.53 3.74,26.53 2.53,27.65 2.53,37.03 3.77,38.18 3.77,38.29 U$2.SD_MISO
  Bottom 0.254: U$2.SDO-MISO 77.04,35.78 77.04,34.86 78.18,33.72 78.18,26.86 77.04,25.72 U$2.T_DO | v9.94,31.32 22.86,31.32 27.52,26.56 43.25,26.56 45.03,28.35 NODEMCU-32S1.P19
SPI_MOSI
  Top 0.254: U$2.T_DIN 77.04,28.23 77.04,29.15 78.18,30.29 78.18,42.29 77.04,43.43 U$2.SDI-MOSI 76.92,43.43 76.47,43.43 61.58,28.65 61.58,27.8 61.09,27.32 49.72,27.32 48.69,28.35 48.69,28.8 48.01,29.49 39.46,29.49 38.72,28.75 38.72,28 37.83,27.12 31.06,27.12 29.83,28.35 NODEMCU-32S1.P23
  Bottom 0.254: NODEMCU-32S1.P23 29.72,28.46 29.19,28.46 24.62,33.03 24,33.03 11.02,46.02 3.73,46.02 2.63,44.92 2.63,42.06 3.77,40.92 U$2.SD_MOSI
T_CS
  Bottom 0.254: NODEMCU-32S1.P33 45.15,2.97 45.83,2.97 47.32,1.49 75.44,1.49 78.75,4.8 78.75,14.66 75.89,17.52 75.89,29.72 76.92,30.75 U$2.T_CS
T_IRQ
  Bottom 0.254: SJ8.1 77.04,20.46 77.04,23.09 U$2.T_IRQ
TFT_CS
  Top 0.254: NODEMCU-32S1.P5 50.18,28.46 52,30 52.46,30.46 54.32,30.46 62.49,38.63 64.58,38.63 76.92,50.98 U$2.CS
TFT_DC  (via drill 0.3)
  Top 0.254: v61.54,30.46 76.92,45.95 U$2.D/C | NODEMCU-32S1.P26 50.18,3.09 50.18,16.28 v50.2,16.3
  Bottom 0.254: v61.54,30.46 61.54,24.29 53.45,16.3 v50.2,16.3
TX  (via drill 0.3)
  Top 0.254: v32.63,48.23 35.09,50.39 35.09,54.33 R16.1
  Bottom 0.254: v32.63,48.23 32.63,41.55 32.72,41.33 32.72,30.7 34.86,28.46 NODEMCU-32S1.TX

### Text on the board
_tsilk: + | SD_CS | SD_MOSI | SD_MISO | SD_SCK | GP_1 | GND | SPI_MOSI | SERVO | TX | RX | GP_1 | GND | SPI_MISO | SPI_CLK | TFT_CS | GP_2 | GP_3 | M2_STEP | M2_DIR | GP_2 | ENC1 | GP_3 | 5V | ENC2 | 3.3V | GND | 3.3V | RESET | ENC1_A | ENC1_B | ENC2_A | ENC2_B | PEN_IRQ | T_CS | SD_CS | TFT_DC | M1_EN | M1_STEP | M1_DIR | GND | M2_EN | 5V
_bsilk: SD CARD | VCC | GND | CS | RESET | D/C | SD_CS | SDI (MOSI) | SD_MOSI | SCK | SD_MISO | LED | SD_SCK | SDO (MISO) | T_CLK (SCK) | T_CS | T_DIN (MOSI) | T_DOUT (MISO) | T_IRQ | Polarshield v3.0c-OPL | An open source art project. / 2018.05.15